# Altium schematic sheet Synchronous Rectification and Filtering.SchDoc
size A; SheetNumber: 7; SheetTotal: 9
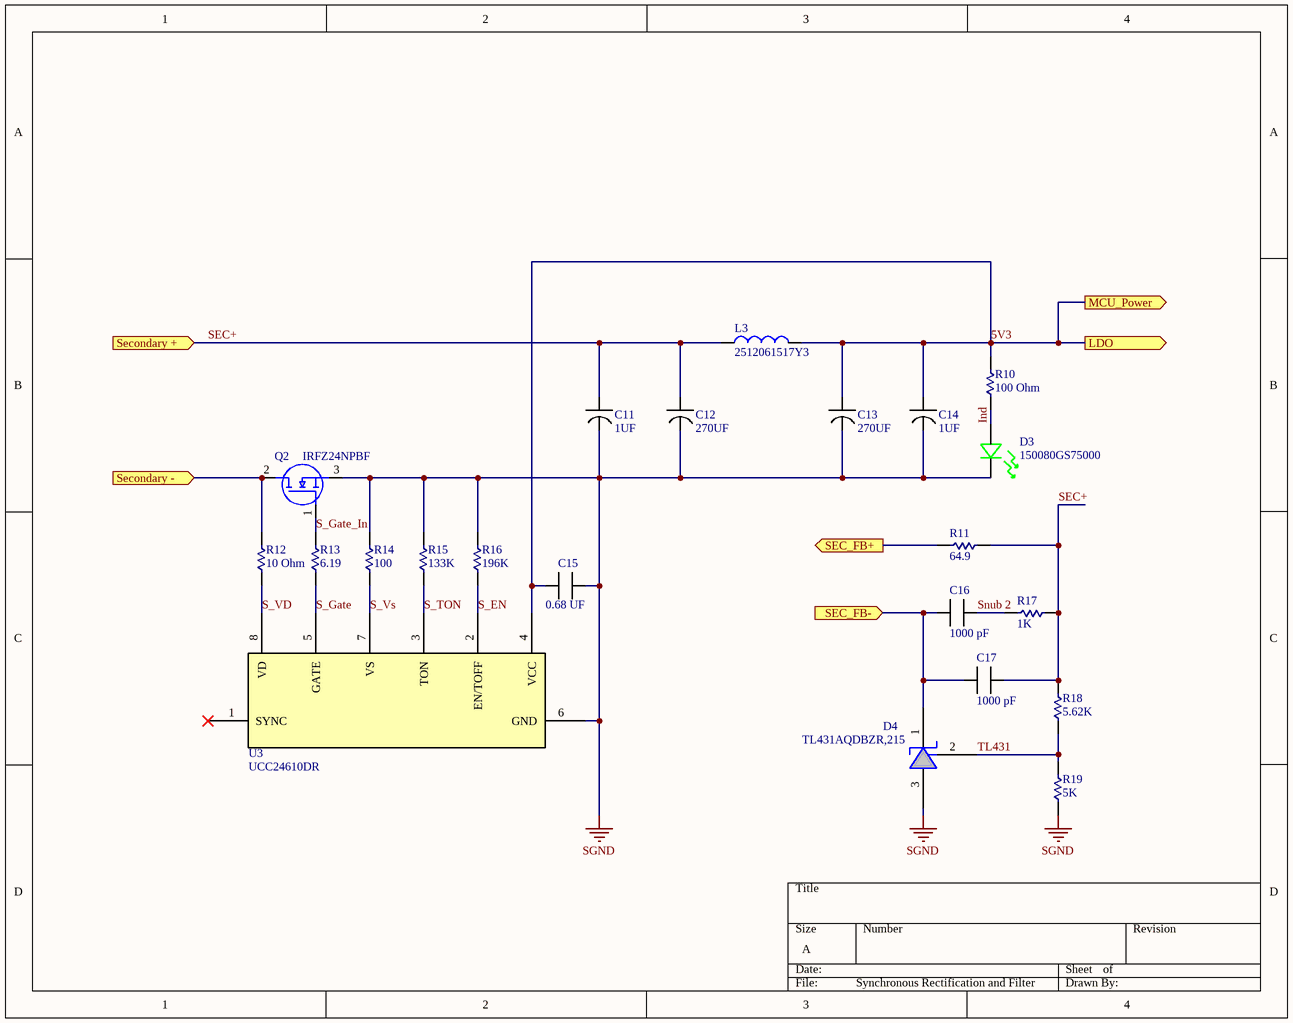
[diagram p0: Synchronous Rectification and Filtering.SchDoc]

## Parts
C11  1UF  [CAP TANTALUM 1206]
C12  270UF  [Alum Radial Cap 5mm]
C13  270UF  [Alum Radial Cap 5mm]
C14  1UF  [CAP TANTALUM 1206]
C15  0.68 UF  [Res 0805]
C16  1000 pF  [Cap 0603]
C17  1000 pF  [Cap 0603]
D3  150080GS75000  [Res 0805]
D4  TL431AQDBZR,215  [SOT23(TO-236AB)_NEX]
L3  2512061517Y3  [IND 1206]
Q2  IRFZ24NPBF  [TO-220-3]
R10  100 Ohm  [Res 0805]
R11  64.9  [Res 0805]
R12  10 Ohm  [Res 0805]
R13  6.19  [Res 0805]
R14  100  [Res 0805]
R15  133K  [Res 0805]
R16  196K  [Res 0805]
R17  1K  [Res 0805]
R18  5.62K  [Res 0805]
R19  5K  [Res 0805]
U3  UCC24610DR  [SOIC-8]

## Ports
LDO (out), MCU_Power (out), SEC_FB+ (out), SEC_FB- (in), Secondary + (in), Secondary - (in)

## Nets
SGND: C11.2 C12.2 C13.2 C14.2 C15.1 D3.1 D4.3 Q2.3(S) R14.2(B) R15.2(B) R16.2(B) R19.1(A) U3.6(GND)
5V3: C13.1 C14.1 C15.2 L3.2 R10.2(B) U3.4(VCC) ; port LDO, port MCU_Power
Ind: D3.2 R10.1(A)
S_EN: R16.1(A) U3.2(EN/TOFF)
S_Gate: R13.1(A) U3.5(GATE)
S_Gate_In: Q2.1(G) R13.2(B)
S_TON: R15.1(A) U3.3(TON)
S_VD: R12.1(A) U3.8(VD)
S_Vs: R14.1(A) U3.7(VS)
SEC+: C11.1 C12.1 C17.1 L3.1 R11.1(A) R17.1(A) R18.2(B) ; port Secondary +
SEC_FB+: R11.2(B) ; port SEC_FB+
SEC_FB-: C16.2 C17.2 D4.1 ; port SEC_FB-
Secondary -: Q2.2(D) R12.2(B) ; port Secondary -
Snub 2: C16.1 R17.2(B)
TL431: D4.2 R18.1(A) R19.2(B)

Not connected (* = marked no-connect by the designer): U3 1(SYNC)*

## Library data of the parts
C11 C14 = T491A105K010AT: Tantalum Capacitors - Solid SMD 10v 1uF 1206 10% ESR=10Ohms; Supplier 1: Mouser; Supplier Part Number 1: 80-T491A105K010AT
C12 C13 = ESY277M050AH4AA: Aluminum Electrolytic Capacitors - Radial Leaded 50V 270uF 105C 4k Hour Radial; Supplier 1: Mouser; Supplier Part Number 1: 80-ESY277M050AH4AA
C15 = C0805C684K5RACAUTO7210: Multilayer Ceramic Capacitors MLCC - SMD/SMT 50V 0.68uF X7R 0805 10% AEC-Q200; Supplier 1: Mouser; Supplier Part Number 1: 80-C0805C684K5RAUTO7
C16 C17 = C0603C102K1RAC7411: Multilayer Ceramic Capacitors MLCC - SMD/SMT 100V 1000pF X7R 0603 10%; Supplier 1: Mouser; Supplier Part Number 1: 80-C0603C102K1RLR
D3 = 150080GS75000: Standard LEDs - SMD WL-SMCW SMDMono TpVw Waterclr 0805 Green; Supplier 1: Mouser; Supplier Part Number 1: 710-150080GS75000
D4 = TL431AQDBZR,215: Shunt Voltage Reference IC Adjustable 2.495V 36 VV ±1% 100 mA TO-236AB; Supplier 1: Mouser; Supplier Part Number 1: 771-TL431AQDBZR215
L3 = 2512061517Y3: Ferrite Beads MULTILAYER CHIP BEAD Z=150 OHM@100MHz 25; Supplier 1: Mouser; Supplier Part Number 1: 623-2512061517Y3
Q2 = IRFZ24NPBF: MOSFET MOSFT 55V 17A 70mOhm 13.3nC; Supplier 1: Mouser; Supplier Part Number 1: 942-IRFZ24NPBF
R10 R14 = RC0805FR-07100RL: Thick Film Resistors - SMD 100 Ohms 125 mW 0805 1%; Supplier 1: Mouser; Supplier Part Number 1: 603-RC0805FR-07100RL
R11 = RT0805FRE0764R9L: Thin Film Resistors - SMD 1/8W 64.9 ohm 1% 50ppm; Supplier 1: Mouser; Supplier Part Number 1: 603-RT0805FRE0764R9L
R12 = AR0805JR-0710RL: Thick Film Resistors - SMD 10Ohms 1/8W 0805 5% 5% AEC-Q200; Supplier 1: Mouser; Supplier Part Number 1: 603-AR0805JR-0710RL
R13 = RC0805FR-076R19L: Thick Film Resistors - SMD 6.19 Ohms 125 mW 0805 1%; Supplier 1: Mouser; Supplier Part Number 1: 603-RC0805FR-076R19L
R15 = RT0805FRE07133KL: Thin Film Resistors - SMD 1/8W 133K ohm 1% 50ppm; Supplier 1: Mouser; Supplier Part Number 1: 603-RT0805FRE07133KL
R16 = RT0805FRE07196KL: Thin Film Resistors - SMD 1/8W 196K ohm 1% 50ppm; Supplier 1: Mouser; Supplier Part Number 1: 603-RT0805FRE07196KL
R17 = AC0805FR-7W1KL: Thick Film Resistors - SMD 1 kOhms 250mW 0805 1 % AEC-Q200 Double Power Version; Supplier 1: Mouser; Supplier Part Number 1: 603-AC0805FR-7W1KL
R18 = RT0805BRD075K62L: Thin Film Resistors - SMD 1/8W 5.62K ohm .1% 25ppm; Supplier 1: Mouser; Supplier Part Number 1: 603-RT0805BRD075K62L
R19 = CRT0805-BY-5001EAS: Thin Film Resistors - SMD 5K OHM .1% 25PPM 1/8W; Supplier 1: Mouser; Supplier Part Number 1: 652-CRT0805BY5001EAS
U3 = UCC24610DR: Gate Drivers Secondary Side Sync Rectifier Controller; Supplier 1: Mouser; Supplier Part Number 1: 595-UCC24610DR